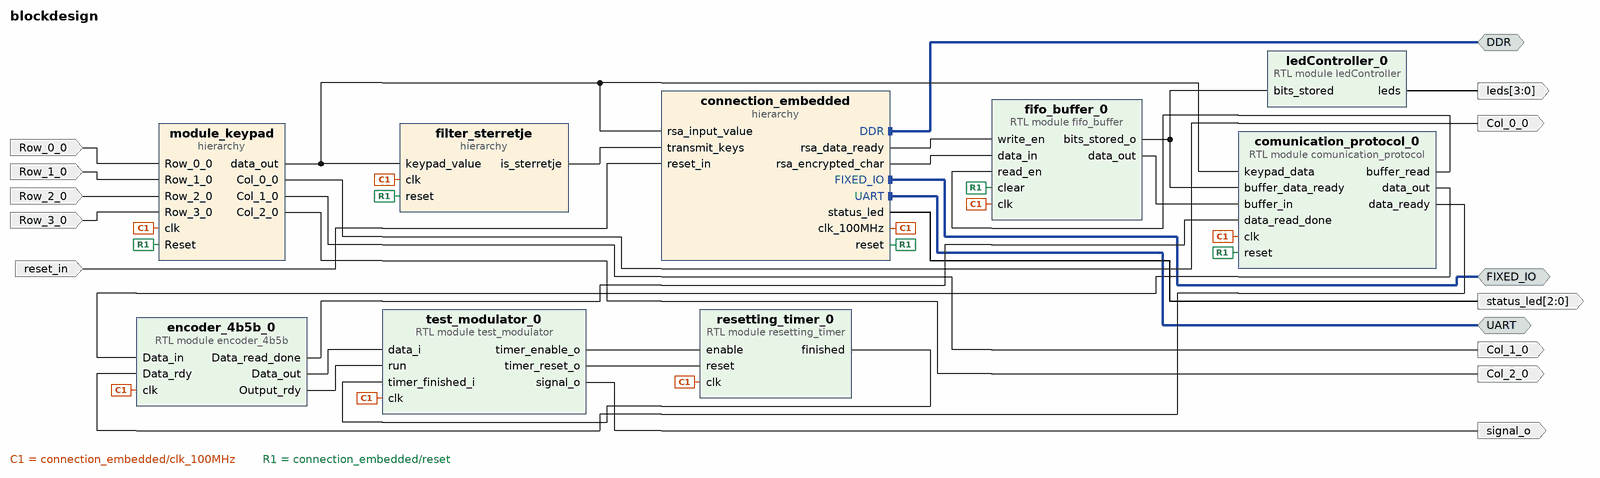
[diagram p0: block diagram of the top level]
# Vivado block design blockdesign, xc7z020clg400-1, Vivado 2023.1
create_bd_design blockdesign

create_bd_intf_port -mode Master -vlnv xilinx.com:interface:ddrx_rtl:1.0 DDR
create_bd_intf_port -mode Master -vlnv xilinx.com:display_processing_system7:fixedio_rtl:1.0 FIXED_IO
create_bd_intf_port -mode Master -vlnv xilinx.com:interface:uart_rtl:1.0 UART
create_bd_port -dir O -from 2 -to 0 status_led
create_bd_port -dir I -type rst reset_in
set_property -dict {CONFIG.POLARITY ACTIVE_HIGH} [get_bd_ports reset_in]
create_bd_port -dir I Row_0_0
create_bd_port -dir I Row_1_0
create_bd_port -dir I Row_2_0
create_bd_port -dir I Row_3_0
create_bd_port -dir O Col_1_0
create_bd_port -dir O Col_2_0
create_bd_port -dir O Col_0_0
create_bd_port -dir O signal_o
create_bd_port -dir O -from 3 -to 0 leds

create_bd_cell -type hier connection_embedded
create_bd_cell -type hier filter_sterretje
create_bd_cell -type hier module_keypad
create_bd_cell -type module -reference fifo_buffer fifo_buffer_0
set_property -dict [list \
  CONFIG.BITS_STORED_WIDTH 8 \
  CONFIG.DEPTH 128 \
  CONFIG.INPUT_WIDTH 32 \
  CONFIG.OUTPUT_WIDTH 128 \
] [get_bd_cells fifo_buffer_0]
create_bd_cell -type module -reference test_modulator test_modulator_0
create_bd_cell -type module -reference encoder_4b5b encoder_4b5b_0
create_bd_cell -type module -reference comunication_protocol comunication_protocol_0
create_bd_cell -type module -reference resetting_timer resetting_timer_0
set_property -dict {CONFIG.goal 100000} [get_bd_cells resetting_timer_0]
create_bd_cell -type module -reference ledController ledController_0

# ---- hierarchy /connection_embedded ----
current_bd_instance /connection_embedded
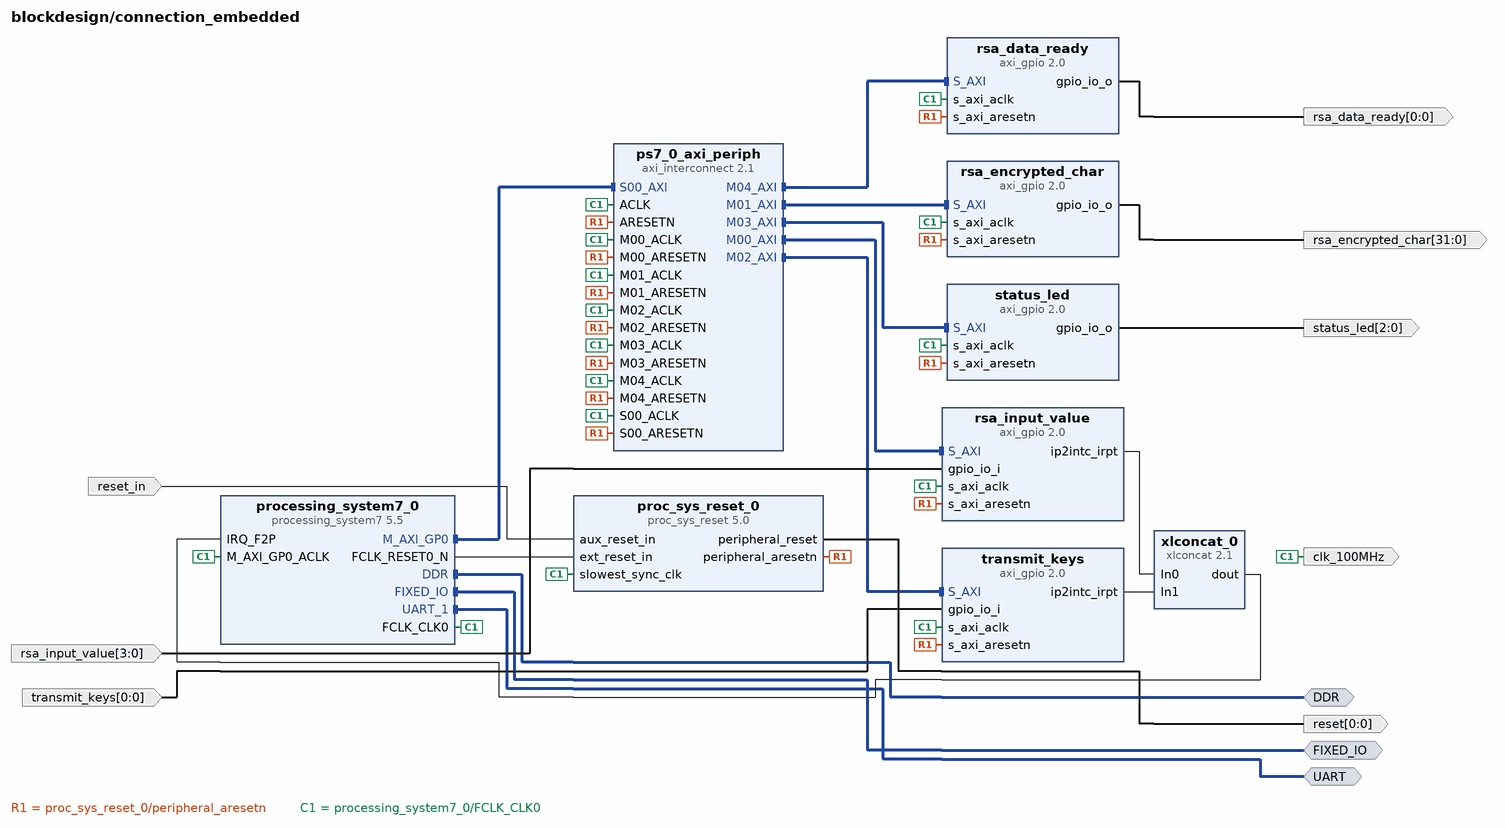
[diagram p1: block diagram inside /connection_embedded]
create_bd_intf_pin -mode Master -vlnv xilinx.com:interface:ddrx_rtl:1.0 DDR
create_bd_intf_pin -mode Master -vlnv xilinx.com:display_processing_system7:fixedio_rtl:1.0 FIXED_IO
create_bd_intf_pin -mode Master -vlnv xilinx.com:interface:uart_rtl:1.0 UART
create_bd_pin -dir O -type clk clk_100MHz
create_bd_pin -dir I -from 0 -to 0 transmit_keys
create_bd_pin -dir I -from 3 -to 0 rsa_input_value
create_bd_pin -dir O -from 2 -to 0 status_led
create_bd_pin -dir O -from 31 -to 0 rsa_encrypted_char
create_bd_pin -dir O -from 0 -to 0 -type rst reset
create_bd_pin -dir I -type rst reset_in
create_bd_pin -dir O -from 0 -to 0 rsa_data_ready

create_bd_cell -type ip -vlnv xilinx.com:ip:axi_gpio:2.0 rsa_input_value
set_property -dict {CONFIG.C_ALL_INPUTS 1 CONFIG.C_GPIO_WIDTH 4 CONFIG.C_INTERRUPT_PRESENT 1} [get_bd_cells rsa_input_value]
create_bd_cell -type ip -vlnv xilinx.com:ip:processing_system7:5.5 processing_system7_0
set_property -dict [list \
  CONFIG.PCW_APU_PERIPHERAL_FREQMHZ 650 \
  CONFIG.PCW_CRYSTAL_PERIPHERAL_FREQMHZ 50 \
  CONFIG.PCW_ENET0_PERIPHERAL_ENABLE 0 \
  CONFIG.PCW_FPGA0_PERIPHERAL_FREQMHZ 100 \
  CONFIG.PCW_FPGA1_PERIPHERAL_FREQMHZ 50 \
  CONFIG.PCW_GPIO_MIO_GPIO_ENABLE 1 \
  CONFIG.PCW_GPIO_MIO_GPIO_IO MIO \
  CONFIG.PCW_I2C_RESET_ENABLE 0 \
  CONFIG.PCW_IRQ_F2P_INTR 1 \
  CONFIG.PCW_M_AXI_GP0_FREQMHZ 10 \
  CONFIG.PCW_PERIPHERAL_BOARD_PRESET part0 \
  CONFIG.PCW_PRESET_BANK1_VOLTAGE {LVCMOS 1.8V} \
  CONFIG.PCW_QSPI_GRP_FBCLK_ENABLE 1 \
  CONFIG.PCW_QSPI_GRP_FBCLK_IO {MIO 8} \
  CONFIG.PCW_QSPI_GRP_SINGLE_SS_ENABLE 1 \
  CONFIG.PCW_QSPI_GRP_SINGLE_SS_IO {MIO 1 .. 6} \
  CONFIG.PCW_QSPI_PERIPHERAL_ENABLE 1 \
  CONFIG.PCW_QSPI_QSPI_IO {MIO 1 .. 6} \
  CONFIG.PCW_SD0_PERIPHERAL_ENABLE 0 \
  CONFIG.PCW_SINGLE_QSPI_DATA_MODE x4 \
  CONFIG.PCW_UART0_PERIPHERAL_ENABLE 1 \
  CONFIG.PCW_UART0_UART0_IO {MIO 14 .. 15} \
  CONFIG.PCW_UART1_PERIPHERAL_ENABLE 1 \
  CONFIG.PCW_UART1_UART1_IO EMIO \
  CONFIG.PCW_UART_PERIPHERAL_FREQMHZ 100 \
  CONFIG.PCW_UIPARAM_DDR_BUS_WIDTH {16 Bit} \
  CONFIG.PCW_UIPARAM_DDR_FREQ_MHZ 525 \
  CONFIG.PCW_UIPARAM_DDR_PARTNO {MT41J256M16 RE-125} \
  CONFIG.PCW_USB0_PERIPHERAL_ENABLE 0 \
  CONFIG.PCW_USB_RESET_ENABLE 1 \
  CONFIG.PCW_USE_FABRIC_INTERRUPT 1 \
] [get_bd_cells processing_system7_0]
# 489 more settings of processing_system7_0 are not shown: defaults, MIO pin electricals, DDR timing, and values the tool derives
create_bd_cell -type ip -vlnv xilinx.com:ip:xlconcat:2.1 xlconcat_0
create_bd_cell -type ip -vlnv xilinx.com:ip:axi_gpio:2.0 rsa_encrypted_char
set_property -dict {CONFIG.C_ALL_OUTPUTS 1 CONFIG.C_GPIO_WIDTH 32} [get_bd_cells rsa_encrypted_char]
create_bd_cell -type ip -vlnv xilinx.com:ip:axi_gpio:2.0 transmit_keys
set_property -dict {CONFIG.C_ALL_INPUTS 1 CONFIG.C_GPIO_WIDTH 1 CONFIG.C_INTERRUPT_PRESENT 1} [get_bd_cells transmit_keys]
create_bd_cell -type ip -vlnv xilinx.com:ip:proc_sys_reset:5.0 proc_sys_reset_0
set_property -dict {CONFIG.C_AUX_RST_WIDTH 1} [get_bd_cells proc_sys_reset_0]
create_bd_cell -type ip -vlnv xilinx.com:ip:axi_gpio:2.0 status_led
set_property -dict {CONFIG.C_ALL_OUTPUTS 1 CONFIG.C_GPIO_WIDTH 3} [get_bd_cells status_led]
create_bd_cell -type ip -vlnv xilinx.com:ip:axi_interconnect:2.1 ps7_0_axi_periph
set_property -dict {CONFIG.NUM_MI 5} [get_bd_cells ps7_0_axi_periph]
create_bd_cell -type ip -vlnv xilinx.com:ip:axi_gpio:2.0 rsa_data_ready
set_property -dict {CONFIG.C_ALL_OUTPUTS 1 CONFIG.C_GPIO_WIDTH 1} [get_bd_cells rsa_data_ready]

# ---- hierarchy /filter_sterretje ----
current_bd_instance /filter_sterretje
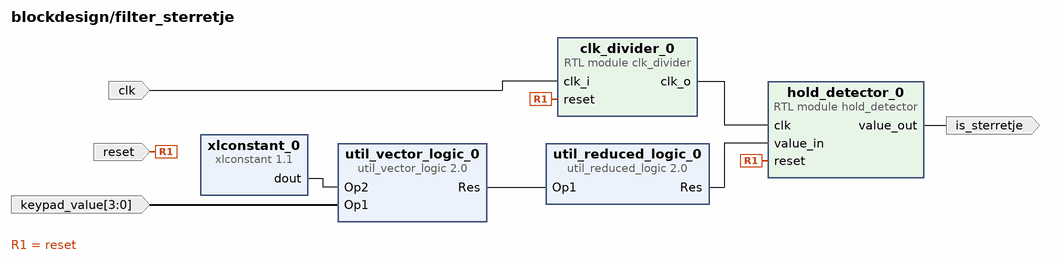
[diagram p2: block diagram inside /filter_sterretje]
create_bd_pin -dir I -from 3 -to 0 keypad_value
create_bd_pin -dir O is_sterretje
create_bd_pin -dir I clk
create_bd_pin -dir I -type rst reset

create_bd_cell -type ip -vlnv xilinx.com:ip:util_vector_logic:2.0 util_vector_logic_0
set_property -dict {CONFIG.C_OPERATION xor CONFIG.C_SIZE 4} [get_bd_cells util_vector_logic_0]
create_bd_cell -type ip -vlnv xilinx.com:ip:xlconstant:1.1 xlconstant_0
set_property -dict {CONFIG.CONST_VAL 4 CONFIG.CONST_WIDTH 4} [get_bd_cells xlconstant_0]
create_bd_cell -type ip -vlnv xilinx.com:ip:util_reduced_logic:2.0 util_reduced_logic_0
set_property -dict {CONFIG.C_SIZE 4} [get_bd_cells util_reduced_logic_0]
create_bd_cell -type module -reference clk_divider clk_divider_0
set_property -dict {CONFIG.division 1000} [get_bd_cells clk_divider_0]
create_bd_cell -type module -reference hold_detector hold_detector_0

# ---- hierarchy /module_keypad ----
current_bd_instance /module_keypad
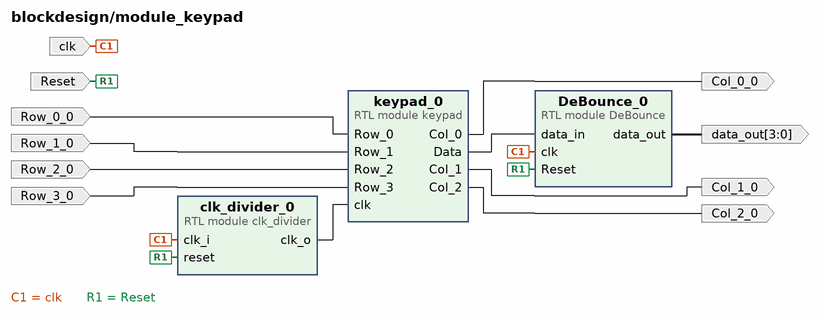
[diagram p3: block diagram inside /module_keypad]
create_bd_pin -dir I -type clk clk
create_bd_pin -dir I -type rst Reset
create_bd_pin -dir O -from 3 -to 0 data_out
create_bd_pin -dir I Row_0_0
create_bd_pin -dir I Row_1_0
create_bd_pin -dir I Row_2_0
create_bd_pin -dir I Row_3_0
create_bd_pin -dir O Col_0_0
create_bd_pin -dir O Col_1_0
create_bd_pin -dir O Col_2_0

create_bd_cell -type module -reference DeBounce DeBounce_0
create_bd_cell -type module -reference keypad keypad_0
create_bd_cell -type module -reference clk_divider clk_divider_0
set_property -dict {CONFIG.division 10000} [get_bd_cells clk_divider_0]

# ---- connections ----

current_bd_instance /connection_embedded
connect_bd_intf_net [get_bd_intf_pins DDR] [get_bd_intf_pins processing_system7_0/DDR]
connect_bd_intf_net [get_bd_intf_pins FIXED_IO] [get_bd_intf_pins processing_system7_0/FIXED_IO]
connect_bd_intf_net [get_bd_intf_pins processing_system7_0/M_AXI_GP0] [get_bd_intf_pins ps7_0_axi_periph/S00_AXI]
connect_bd_intf_net [get_bd_intf_pins UART] [get_bd_intf_pins processing_system7_0/UART_1]
connect_bd_intf_net [get_bd_intf_pins ps7_0_axi_periph/M00_AXI] [get_bd_intf_pins rsa_input_value/S_AXI]
connect_bd_intf_net [get_bd_intf_pins ps7_0_axi_periph/M01_AXI] [get_bd_intf_pins rsa_encrypted_char/S_AXI]
connect_bd_intf_net [get_bd_intf_pins ps7_0_axi_periph/M02_AXI] [get_bd_intf_pins transmit_keys/S_AXI]
connect_bd_intf_net [get_bd_intf_pins ps7_0_axi_periph/M03_AXI] [get_bd_intf_pins status_led/S_AXI]
connect_bd_intf_net [get_bd_intf_pins ps7_0_axi_periph/M04_AXI] [get_bd_intf_pins rsa_data_ready/S_AXI]
connect_bd_net -net aux_reset_in_0_1 [get_bd_pins reset_in] [get_bd_pins proc_sys_reset_0/aux_reset_in]
connect_bd_net -net axi_gpio_0_ip2intc_irpt [get_bd_pins rsa_input_value/ip2intc_irpt] [get_bd_pins xlconcat_0/In0]
connect_bd_net -net axi_gpio_2_ip2intc_irpt [get_bd_pins transmit_keys/ip2intc_irpt] [get_bd_pins xlconcat_0/In1]
connect_bd_net -net gpio_io_i_0_1 [get_bd_pins transmit_keys] [get_bd_pins transmit_keys/gpio_io_i]
connect_bd_net -net gpio_io_i_1_1 [get_bd_pins rsa_input_value] [get_bd_pins rsa_input_value/gpio_io_i]
connect_bd_net [get_bd_pins proc_sys_reset_0/peripheral_aresetn] \
  [get_bd_pins ps7_0_axi_periph/S00_ARESETN] [get_bd_pins rsa_input_value/s_axi_aresetn] \
  [get_bd_pins ps7_0_axi_periph/M00_ARESETN] [get_bd_pins ps7_0_axi_periph/ARESETN] \
  [get_bd_pins rsa_encrypted_char/s_axi_aresetn] [get_bd_pins ps7_0_axi_periph/M01_ARESETN] \
  [get_bd_pins transmit_keys/s_axi_aresetn] [get_bd_pins ps7_0_axi_periph/M02_ARESETN] [get_bd_pins status_led/s_axi_aresetn] \
  [get_bd_pins ps7_0_axi_periph/M03_ARESETN] [get_bd_pins rsa_data_ready/s_axi_aresetn] \
  [get_bd_pins ps7_0_axi_periph/M04_ARESETN]
connect_bd_net [get_bd_pins proc_sys_reset_0/peripheral_reset] [get_bd_pins reset]
connect_bd_net [get_bd_pins processing_system7_0/FCLK_CLK0] \
  [get_bd_pins clk_100MHz] [get_bd_pins proc_sys_reset_0/slowest_sync_clk] [get_bd_pins processing_system7_0/M_AXI_GP0_ACLK] \
  [get_bd_pins ps7_0_axi_periph/S00_ACLK] [get_bd_pins ps7_0_axi_periph/M00_ACLK] [get_bd_pins ps7_0_axi_periph/ACLK] \
  [get_bd_pins rsa_encrypted_char/s_axi_aclk] [get_bd_pins ps7_0_axi_periph/M01_ACLK] [get_bd_pins transmit_keys/s_axi_aclk] \
  [get_bd_pins ps7_0_axi_periph/M02_ACLK] [get_bd_pins status_led/s_axi_aclk] [get_bd_pins ps7_0_axi_periph/M03_ACLK] \
  [get_bd_pins rsa_input_value/s_axi_aclk] [get_bd_pins rsa_data_ready/s_axi_aclk] [get_bd_pins ps7_0_axi_periph/M04_ACLK]
connect_bd_net [get_bd_pins processing_system7_0/FCLK_RESET0_N] [get_bd_pins proc_sys_reset_0/ext_reset_in]
connect_bd_net -net rsa_encrypted_char1_gpio_io_o [get_bd_pins rsa_data_ready/gpio_io_o] [get_bd_pins rsa_data_ready]
connect_bd_net [get_bd_pins rsa_encrypted_char/gpio_io_o] [get_bd_pins rsa_encrypted_char]
connect_bd_net [get_bd_pins status_led/gpio_io_o] [get_bd_pins status_led]
connect_bd_net [get_bd_pins xlconcat_0/dout] [get_bd_pins processing_system7_0/IRQ_F2P]

current_bd_instance /filter_sterretje
connect_bd_net [get_bd_pins clk_divider_0/clk_o] [get_bd_pins hold_detector_0/clk]
connect_bd_net -net clk_i_1 [get_bd_pins clk] [get_bd_pins clk_divider_0/clk_i]
connect_bd_net [get_bd_pins hold_detector_0/value_out] [get_bd_pins is_sterretje]
connect_bd_net -net keypad_0_Data [get_bd_pins keypad_value] [get_bd_pins util_vector_logic_0/Op1]
connect_bd_net [get_bd_pins reset] [get_bd_pins clk_divider_0/reset] [get_bd_pins hold_detector_0/reset]
connect_bd_net [get_bd_pins util_reduced_logic_0/Res] [get_bd_pins hold_detector_0/value_in]
connect_bd_net [get_bd_pins util_vector_logic_0/Res] [get_bd_pins util_reduced_logic_0/Op1]
connect_bd_net [get_bd_pins xlconstant_0/dout] [get_bd_pins util_vector_logic_0/Op2]

current_bd_instance /module_keypad
connect_bd_net -net Row_0_0_1 [get_bd_pins Row_0_0] [get_bd_pins keypad_0/Row_0]
connect_bd_net -net Row_1_0_1 [get_bd_pins Row_1_0] [get_bd_pins keypad_0/Row_1]
connect_bd_net -net Row_2_0_1 [get_bd_pins Row_2_0] [get_bd_pins keypad_0/Row_2]
connect_bd_net -net Row_3_0_1 [get_bd_pins Row_3_0] [get_bd_pins keypad_0/Row_3]
connect_bd_net [get_bd_pins clk_divider_0/clk_o] [get_bd_pins keypad_0/clk]
connect_bd_net -net connection_embedded_clk_100MHz [get_bd_pins clk] [get_bd_pins DeBounce_0/clk] [get_bd_pins clk_divider_0/clk_i]
connect_bd_net -net connection_embedded_reset [get_bd_pins Reset] [get_bd_pins DeBounce_0/Reset] [get_bd_pins clk_divider_0/reset]
connect_bd_net [get_bd_pins keypad_0/Col_0] [get_bd_pins Col_0_0]
connect_bd_net [get_bd_pins keypad_0/Col_1] [get_bd_pins Col_1_0]
connect_bd_net [get_bd_pins keypad_0/Col_2] [get_bd_pins Col_2_0]
connect_bd_net -net keypad_0_Data [get_bd_pins DeBounce_0/data_out] [get_bd_pins data_out]
connect_bd_net [get_bd_pins keypad_0/Data] [get_bd_pins DeBounce_0/data_in]

current_bd_instance /
connect_bd_intf_net -intf_net processing_system7_0_DDR [get_bd_intf_ports DDR] [get_bd_intf_pins connection_embedded/DDR]
connect_bd_intf_net -intf_net processing_system7_0_FIXED_IO [get_bd_intf_ports FIXED_IO] [get_bd_intf_pins connection_embedded/FIXED_IO]
connect_bd_intf_net -intf_net processing_system7_0_UART_1 [get_bd_intf_ports UART] [get_bd_intf_pins connection_embedded/UART]
connect_bd_net -net Row_0_0_1 [get_bd_ports Row_0_0] [get_bd_pins module_keypad/Row_0_0]
connect_bd_net -net Row_1_0_1 [get_bd_ports Row_1_0] [get_bd_pins module_keypad/Row_1_0]
connect_bd_net -net Row_2_0_1 [get_bd_ports Row_2_0] [get_bd_pins module_keypad/Row_2_0]
connect_bd_net -net Row_3_0_1 [get_bd_ports Row_3_0] [get_bd_pins module_keypad/Row_3_0]
connect_bd_net -net aux_reset_in_0_1 [get_bd_ports reset_in] [get_bd_pins connection_embedded/reset_in]
connect_bd_net [get_bd_pins comunication_protocol_0/buffer_read] [get_bd_pins fifo_buffer_0/read_en]
connect_bd_net [get_bd_pins comunication_protocol_0/data_out] [get_bd_pins encoder_4b5b_0/Data_in]
connect_bd_net [get_bd_pins comunication_protocol_0/data_ready] [get_bd_pins encoder_4b5b_0/Data_rdy]
connect_bd_net [get_bd_pins connection_embedded/clk_100MHz] \
  [get_bd_pins filter_sterretje/clk] [get_bd_pins module_keypad/clk] [get_bd_pins fifo_buffer_0/clk] \
  [get_bd_pins test_modulator_0/clk] [get_bd_pins encoder_4b5b_0/clk] [get_bd_pins comunication_protocol_0/clk] \
  [get_bd_pins resetting_timer_0/clk]
connect_bd_net [get_bd_pins connection_embedded/reset] \
  [get_bd_pins filter_sterretje/reset] [get_bd_pins module_keypad/Reset] [get_bd_pins fifo_buffer_0/clear] \
  [get_bd_pins comunication_protocol_0/reset]
connect_bd_net [get_bd_pins connection_embedded/rsa_data_ready] [get_bd_pins fifo_buffer_0/write_en]
connect_bd_net [get_bd_pins connection_embedded/rsa_encrypted_char] [get_bd_pins fifo_buffer_0/data_in]
connect_bd_net [get_bd_pins connection_embedded/status_led] [get_bd_ports status_led]
connect_bd_net [get_bd_pins encoder_4b5b_0/Data_out] [get_bd_pins test_modulator_0/data_i]
connect_bd_net [get_bd_pins encoder_4b5b_0/Data_read_done] [get_bd_pins comunication_protocol_0/data_read_done]
connect_bd_net [get_bd_pins encoder_4b5b_0/Output_rdy] [get_bd_pins test_modulator_0/run]
connect_bd_net [get_bd_pins fifo_buffer_0/bits_stored_o] \
  [get_bd_pins comunication_protocol_0/buffer_data_ready] [get_bd_pins ledController_0/bits_stored]
connect_bd_net [get_bd_pins fifo_buffer_0/data_out] [get_bd_pins comunication_protocol_0/buffer_in]
connect_bd_net -net keypad_0_Col_0 [get_bd_pins module_keypad/Col_0_0] [get_bd_ports Col_0_0]
connect_bd_net -net keypad_0_Col_1 [get_bd_pins module_keypad/Col_1_0] [get_bd_ports Col_1_0]
connect_bd_net -net keypad_0_Col_2 [get_bd_pins module_keypad/Col_2_0] [get_bd_ports Col_2_0]
connect_bd_net -net keypad_0_Data [get_bd_pins module_keypad/data_out] \
  [get_bd_pins connection_embedded/rsa_input_value] [get_bd_pins filter_sterretje/keypad_value] \
  [get_bd_pins comunication_protocol_0/keypad_data]
connect_bd_net [get_bd_pins ledController_0/leds] [get_bd_ports leds]
connect_bd_net [get_bd_pins resetting_timer_0/finished] [get_bd_pins test_modulator_0/timer_finished_i]
connect_bd_net [get_bd_pins test_modulator_0/signal_o] [get_bd_ports signal_o]
connect_bd_net [get_bd_pins test_modulator_0/timer_enable_o] [get_bd_pins resetting_timer_0/enable]
connect_bd_net [get_bd_pins test_modulator_0/timer_reset_o] [get_bd_pins resetting_timer_0/reset]
connect_bd_net -net util_reduced_logic_0_Res [get_bd_pins filter_sterretje/is_sterretje] [get_bd_pins connection_embedded/transmit_keys]

# ---- address map ----
assign_bd_address -offset 0x41200000 -range 64K -target_address_space [get_bd_addr_spaces connection_embedded/processing_system7_0/Data] [get_bd_addr_segs connection_embedded/rsa_input_value/S_AXI/Reg]
assign_bd_address -offset 0x41210000 -range 64K -target_address_space [get_bd_addr_spaces connection_embedded/processing_system7_0/Data] [get_bd_addr_segs connection_embedded/rsa_encrypted_char/S_AXI/Reg]
assign_bd_address -offset 0x41220000 -range 64K -target_address_space [get_bd_addr_spaces connection_embedded/processing_system7_0/Data] [get_bd_addr_segs connection_embedded/transmit_keys/S_AXI/Reg]
assign_bd_address -offset 0x41230000 -range 64K -target_address_space [get_bd_addr_spaces connection_embedded/processing_system7_0/Data] [get_bd_addr_segs connection_embedded/status_led/S_AXI/Reg]
assign_bd_address -offset 0x41240000 -range 64K -target_address_space [get_bd_addr_spaces connection_embedded/processing_system7_0/Data] [get_bd_addr_segs connection_embedded/rsa_data_ready/S_AXI/Reg]

validate_bd_design
save_bd_design
